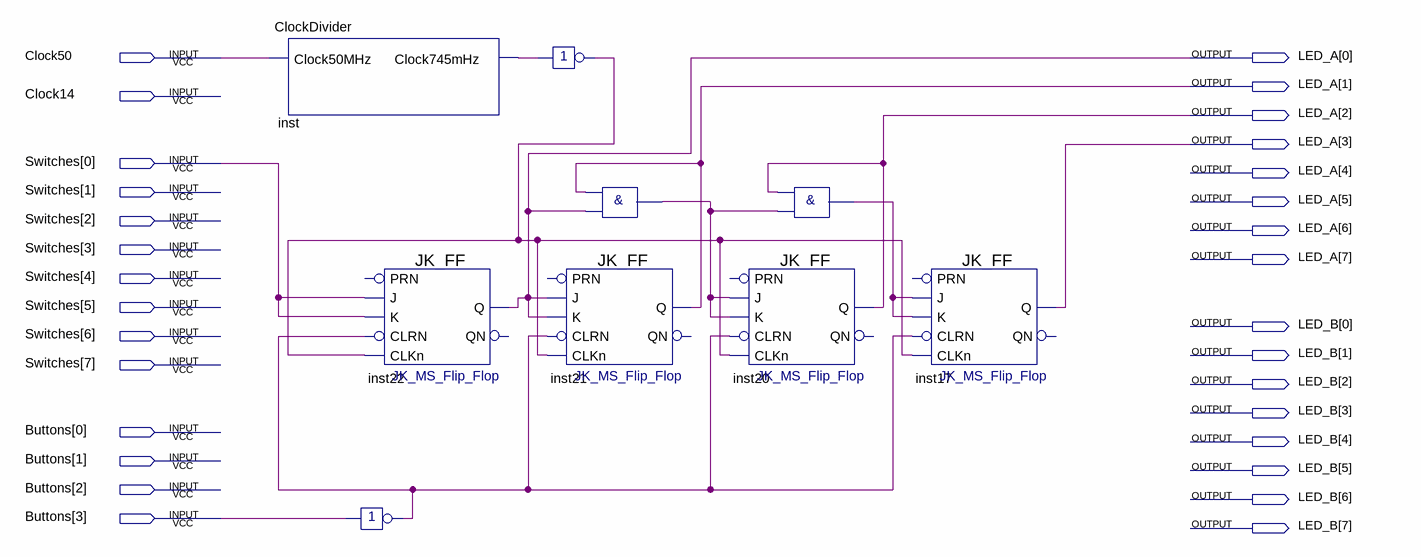
[diagram p0: schematic sheet]
// Quartus schematic 4BitSynchronzaehler.bdf as structural Verilog: 9 symbols, 30 pins
module \4BitSynchronzaehler  (
  input  Clock50,
  input  Clock14,
  input  [7:0] Switches,
  input  [3:0] Buttons,
  output [7:0] LED_A,
  output [7:0] LED_B
);

  wire inst15_out, inst16_out, inst18_out, inst19_out, inst_clock745mhz;

  ClockDivider inst (.Clock50MHz(Clock50), .Clock745mHz(inst_clock745mhz));
  JK_FF inst22 (.K(Switches[0]), .J(Switches[0]), .CLRN(inst18_out), .CLKn(inst19_out), .Q(LED_A[0]));  // open: PRN, QN
  not inst18 (inst18_out, Buttons[3]);
  not inst19 (inst19_out, inst_clock745mhz);
  JK_FF inst21 (.K(LED_A[0]), .J(LED_A[0]), .CLRN(inst18_out), .CLKn(inst19_out), .Q(LED_A[1]));  // open: PRN, QN
  and inst15 (inst15_out, LED_A[1], LED_A[0]);
  and inst16 (inst16_out, LED_A[2], inst15_out);
  JK_FF inst20 (.K(inst15_out), .J(inst15_out), .CLRN(inst18_out), .CLKn(inst19_out), .Q(LED_A[2]));  // open: PRN, QN
  JK_FF inst17 (.K(inst16_out), .J(inst16_out), .CLRN(inst18_out), .CLKn(inst19_out), .Q(LED_A[3]));  // open: PRN, QN
endmodule
